# EAGLE design M106X (EAGLE 6.6.0)
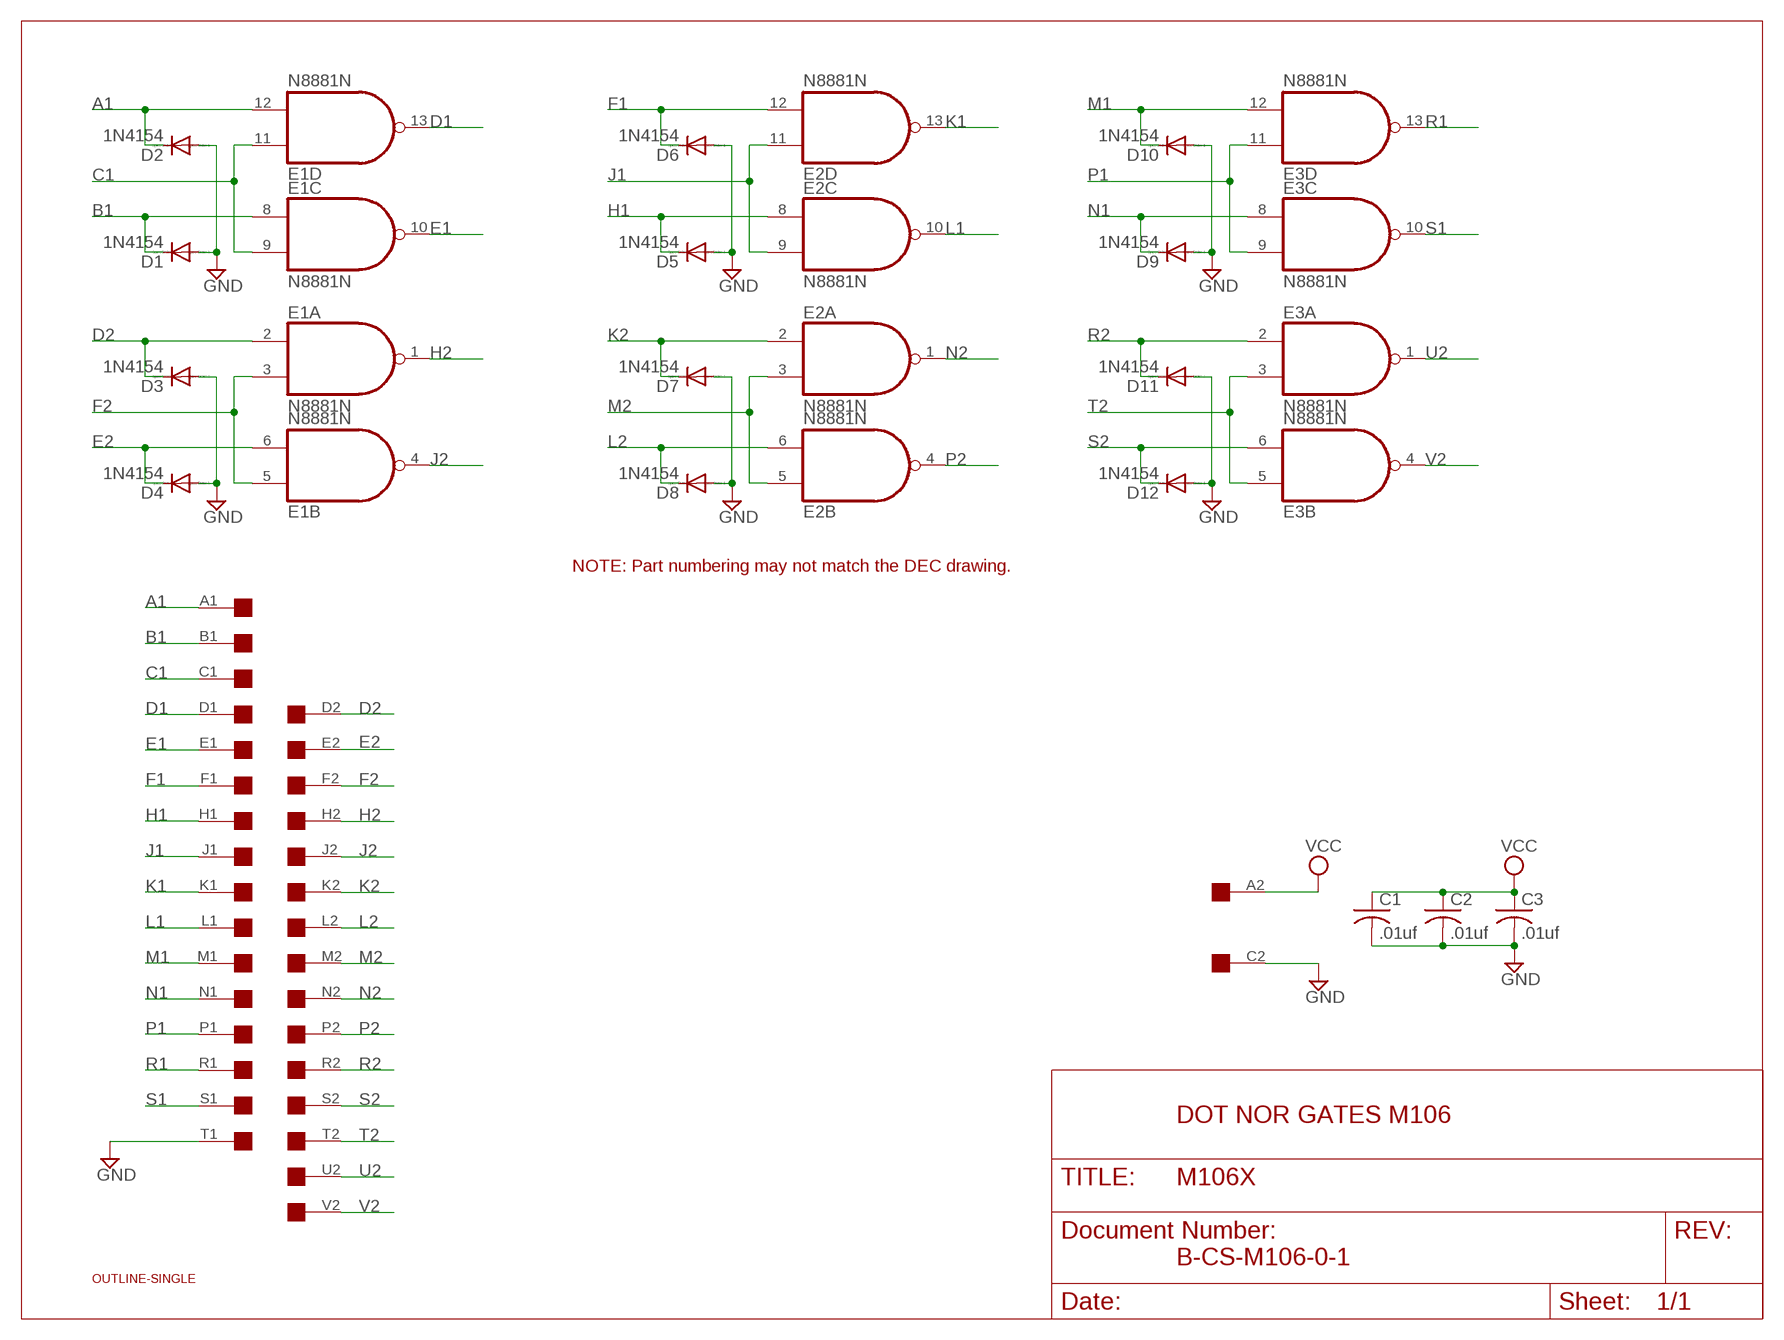
[diagram p0: schematic, sheet 1]

## Parts
C1  .01uf  C-US050-025X075  [C050-025X075]
C2  .01uf  C-US050-025X075  [C050-025X075]
C3  .01uf  C-US050-025X075  [C050-025X075]
D1  1N4154  1N4148DO35-10  [DO35-10]
D2  1N4154  1N4148DO35-10  [DO35-10]
D3  1N4154  1N4148DO35-10  [DO35-10]
D4  1N4154  1N4148DO35-10  [DO35-10]
D5  1N4154  1N4148DO35-10  [DO35-10]
D6  1N4154  1N4148DO35-10  [DO35-10]
D7  1N4154  1N4148DO35-10  [DO35-10]
D8  1N4154  1N4148DO35-10  [DO35-10]
D9  1N4154  1N4148DO35-10  [DO35-10]
D10  1N4154  1N4148DO35-10  [DO35-10]
D11  1N4154  1N4148DO35-10  [DO35-10]
D12  1N4154  1N4148DO35-10  [DO35-10]
E1  N8881N  [DIL14]
E2  N8881N  [DIL14]
E3  N8881N  [DIL14]
U$1  SINGLE  [EDGE-CON2]
U$4  OUTLINE-SINGLE  [SINGLE]

## Nets
A1: D2.C E1.12(D:I1) U$1.A1
B1: D1.C E1.8(C:I0) U$1.B1
C1: E1.9(C:I1) E1.11(D:I0) U$1.C1
D1: E1.13(D:O) U$1.D1
D2: D3.C E1.2(A:I0) U$1.D2
E1: E1.10(C:O) U$1.E1
E2: D4.C E1.6(B:I1) U$1.E2
F1: D6.C E2.12(D:I1) U$1.F1
F2: E1.3(A:I1) E1.5(B:I0) U$1.F2
GND [Supply]: C1.2 C2.2 C3.2 D1.A D2.A D3.A D4.A D5.A D6.A D7.A D8.A D9.A D10.A D11.A D12.A U$1.C2 U$1.T1
H1: D5.C E2.8(C:I0) U$1.H1
H2: E1.1(A:O) U$1.H2
J1: E2.9(C:I1) E2.11(D:I0) U$1.J1
J2: E1.4(B:O) U$1.J2
K1: E2.13(D:O) U$1.K1
K2: D7.C E2.2(A:I0) U$1.K2
L1: E2.10(C:O) U$1.L1
L2: D8.C E2.6(B:I1) U$1.L2
M1: D10.C E3.12(D:I1) U$1.M1
M2: E2.3(A:I1) E2.5(B:I0) U$1.M2
N1: D9.C E3.8(C:I0) U$1.N1
N2: E2.1(A:O) U$1.N2
P1: E3.9(C:I1) E3.11(D:I0) U$1.P1
P2: E2.4(B:O) U$1.P2
R1: E3.13(D:O) U$1.R1
R2: D11.C E3.2(A:I0) U$1.R2
S1: E3.10(C:O) U$1.S1
S2: D12.C E3.6(B:I1) U$1.S2
T2: E3.3(A:I1) E3.5(B:I0) U$1.T2
U2: E3.1(A:O) U$1.U2
V2: E3.4(B:O) U$1.V2
VCC [Supply]: C1.1 C2.1 C3.1 U$1.A2
Unconnected: U$1.B2 U$1.U1 U$1.V1

## Notes on the sheet
- NOTE: Part numbering may not match the DEC drawing.
- DOT NOR GATES M106
- B-CS-M106-0-1

## Power pins joined to a net without a drawn wire
GND: E1.7(P:GND) E2.7(P:GND) E3.7(P:GND)
VCC: E1.14(P:VCC) E2.14(P:VCC) E3.14(P:VCC)

## Library data of the parts
C1-C3 = rcl:C-US: CAPACITOR, American symbol
D1-D12 = diode:1N4148: DIODE high speed (Philips)
E1-E3 = dec-con:N8881: Quad 2-input NAND gate, open collector
U$1 = dec-con:SINGLE: Single-Height DEC board
U$4 = dec-con:OUTLINE-*: Board outlines for DEC boards.

## Net classes
1 Supply: width 0.813 mm

## Board
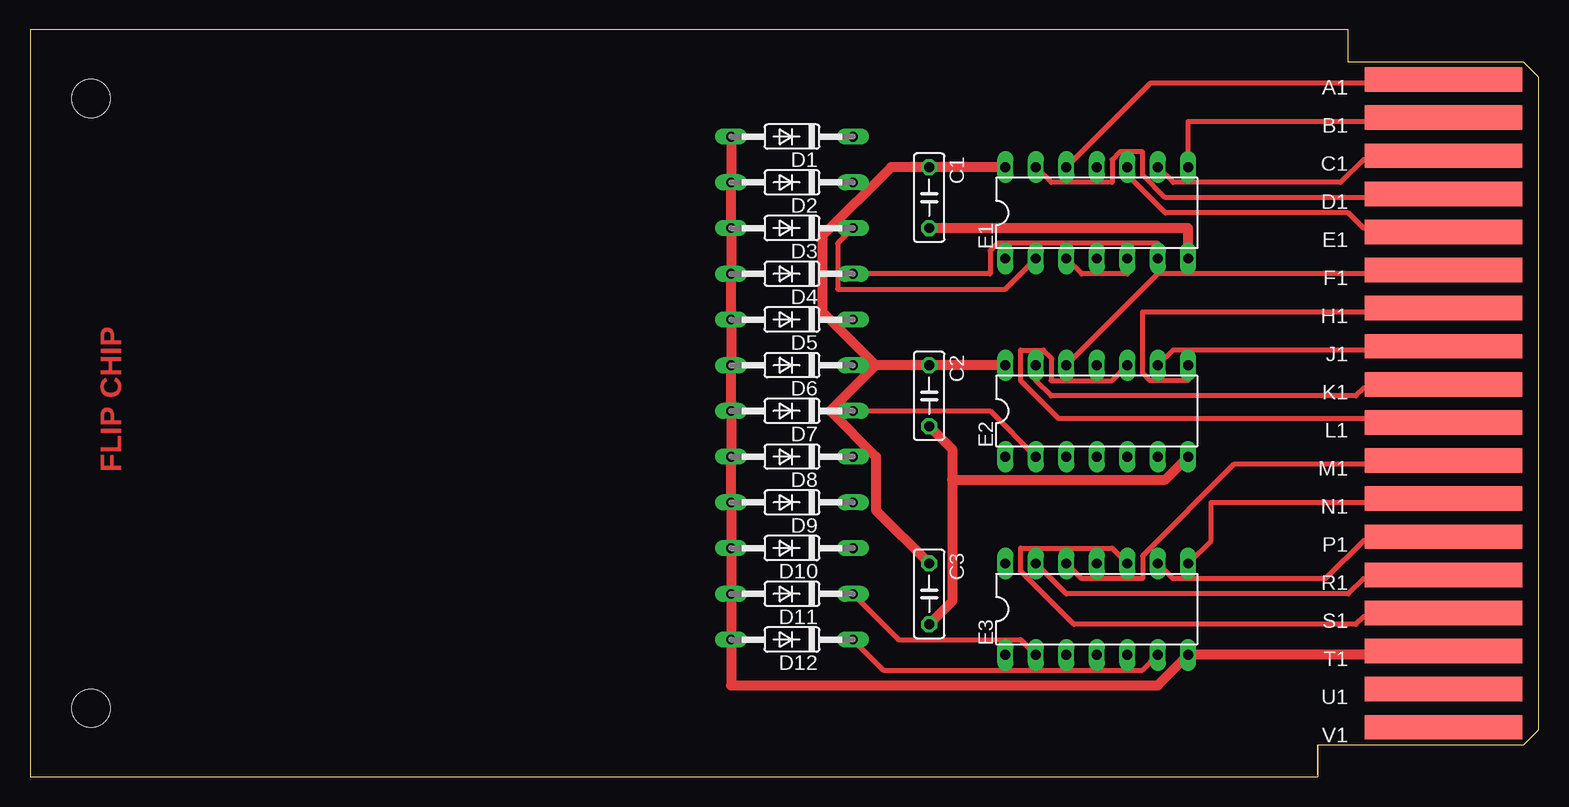
[diagram p1: board, top side]
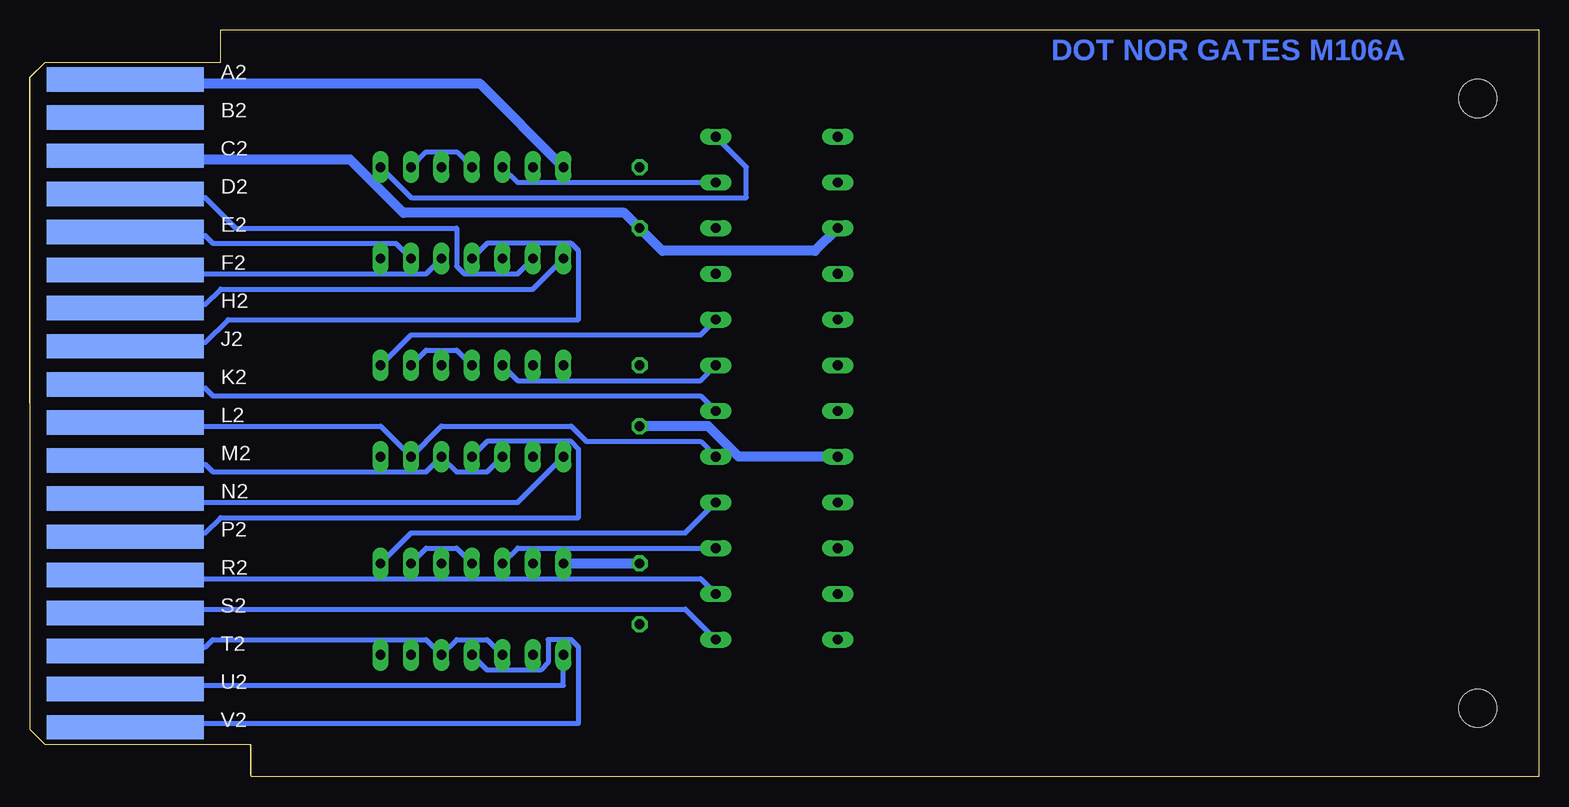
[diagram p2: board, bottom side, seen from below]

Size 125.73 x 62.23 mm. Coordinates in mm from the lower left corner, seen from the top.
Copper layers (1+16): Top 0.035mm / dielectric 1.5mm / Bottom 0.035mm
Design rules "16mils": minimum track width 16mil, minimum drill 32mil, track to track 15mil, track to pad 10mil, pad to pad 10mil, via to via 10mil, smd to smd 10mil, copper to edge 13mil, drill to drill 10mil, minimum pad ring 10mil, minimum via ring 8mil, stop-mask expansion 0mil, vias tented up to drill 0mil, thermal gap 10mil

### Footprints (pad centres in the part's own frame; a part is rotated, then mirrored left to right if it is on the bottom)
C050-025X075 = drill 0.813 octagon: 1 -2.54,0; 2 2.54,0
DO35-10 = drill 0.813 long: A 5.08,0; C -5.08,0
DIL14 = drill 0.813 long: 1 -7.62,-3.81; 2 -5.08,-3.81; 3 -2.54,-3.81; 4 0,-3.81; 5 2.54,-3.81; 6 5.08,-3.81; 7 7.62,-3.81; 8 7.62,3.81; 9 5.08,3.81; 10 2.54,3.81; 11 0,3.81; 12 -2.54,3.81; 13 -5.08,3.81; 14 -7.62,3.81
EDGE-CON2 = smd 13.106 x 2.032: A1 7.938,4.128; B1 7.938,7.303; C1 7.938,10.477; D1 7.938,13.652; E1 7.938,16.828; F1 7.938,20.003; H1 7.938,23.177; J1 7.938,26.352; K1 7.938,29.527; L1 7.938,32.703; M1 7.938,35.877; N1 7.938,39.053; P1 7.938,42.227; R1 7.938,45.403; S1 7.938,48.578; T1 7.938,51.752; U1 7.938,54.928; V1 7.938,58.102 | smd 13.106 x 2.032 bottom: A2 7.938,4.128; B2 7.938,7.303; C2 7.938,10.477; D2 7.938,13.652; E2 7.938,16.828; F2 7.938,20.003; H2 7.938,23.177; J2 7.938,26.352; K2 7.938,29.527; L2 7.938,32.703; M2 7.938,35.877; N2 7.938,39.053; P2 7.938,42.227; R2 7.938,45.403; S2 7.938,48.578; T2 7.938,51.752; U2 7.938,54.928; V2 7.938,58.102
SINGLE = hole 3.175: 120.65,56.515; 120.65,5.715

### Placement (x,y rotation side)
C1  74.93,48.26 270 top
C2  74.93,31.75 270 top
C3  74.93,15.24 270 top
D1  63.5,53.34 180 top
D2  63.5,49.53 180 top
D3  63.5,45.72 180 top
D4  63.5,41.91 180 top
D5  63.5,38.1 180 top
D6  63.5,34.29 180 top
D7  63.5,30.48 180 top
D8  63.5,26.67 180 top
D9  63.5,22.86 180 top
D10  63.5,19.05 180 top
D11  63.5,15.24 180 top
D12  63.5,11.43 180 top
E1  88.9,46.99 0 top
E2  88.9,30.48 0 top
E3  88.9,13.97 0 top
U$1  125.73,62.23 180 top
U$4  125.73,62.23 180 top

### Tracks (layer width: path | path; a pad name or v marks a point on that pad's centre or on a via)
A1
  Top 0.406: E1.12 93.34,57.78 117.47,57.78 U$1.A1
  Bottom 0.406: D2.C 85.09,49.53 E1.12
B1
  Top 0.406: E1.8 96.52,54.61 117.47,54.61 U$1.B1
  Bottom 0.406: D1.C 66.04,50.8 66.04,48.26 93.98,48.26 E1.8
C1
  Top 0.406: E1.9 95.25,49.53 109.22,49.53 111.12,51.44 117.47,51.44 U$1.C1
  Bottom 0.406: E1.11 90.17,52.07 92.71,52.07 E1.9
D1
  Top 0.406: E1.13 85.09,49.53 90.17,49.53 90.17,51.44 90.81,52.07 92.71,52.07 92.71,50.16 94.61,48.26 117.47,48.26 U$1.D1
D2
  Top 0.406: E1.2 81.28,40.64 67.31,40.64 67.31,44.45 D3.C
  Bottom 0.406: E1.2 85.09,41.91 89.53,41.91 90.17,42.55 90.17,45.72 108.58,45.72 111.12,48.26 117.47,48.26 U$1.D2
E1
  Top 0.406: E1.10 91.44,50.16 94.61,46.99 109.86,46.99 111.12,45.72 117.47,45.72 U$1.E1
E2
  Top 0.406: D4.C 80.01,41.91 80.01,43.81 80.64,44.45 93.98,44.45 E1.6
  Bottom 0.406: E1.6 95.25,44.45 110.49,44.45 111.12,45.09 117.47,45.09 U$1.E2
F1
  Top 0.406: E2.12 93.98,41.91 117.47,41.91 U$1.F1
  Bottom 0.406: D6.C 69.85,33.02 85.09,33.02 E2.12
F2
  Top 0.406: E1.3 87.63,41.91 91.44,41.91 E1.5
  Bottom 0.406: E1.5 92.71,41.91 117.47,41.91 U$1.F2
GND
  Top 0.813: U$1.T1 117.47,10.16 E3.7 93.98,7.62 58.42,7.62 D12.A D11.A D10.A D9.A D8.A D7.A D6.A D5.A D4.A D3.A D2.A D1.A | C3.2 76.83,14.61 76.83,24.77 | 76.83,24.77 76.83,27.3 C2.2 | E2.7 94.61,24.77 76.83,24.77 | C1.2 96.52,45.72 E1.7
  Bottom 0.813: D3.A 60.33,43.81 73.03,43.81 C1.2 76.2,46.99 94.61,46.99 99.06,51.44 117.47,51.44 U$1.C2 | C2.2 69.22,29.21 66.67,26.67 D8.A
H1
  Top 0.406: E2.8 96.52,33.02 93.34,33.02 92.71,33.66 92.71,38.73 117.47,38.73 U$1.H1
  Bottom 0.406: D5.C 69.85,36.83 93.98,36.83 E2.8
H2
  Bottom 0.406: E1.1 83.82,40.64 109.86,40.64 111.12,39.37 117.47,39.37 U$1.H2
J1
  Top 0.406: E2.9 95.25,35.56 117.47,35.56 U$1.J1
  Bottom 0.406: E2.11 90.17,35.56 92.71,35.56 E2.9
J2
  Bottom 0.406: E1.4 87.63,44.45 80.64,44.45 80.01,43.81 80.01,38.1 109.22,38.1 111.12,36.2 117.47,36.2 U$1.J2
K1
  Top 0.406: E2.13 83.82,33.02 85.09,31.75 110.49,31.75 111.12,32.38 117.47,32.38 U$1.K1
K2
  Top 0.406: E2.2 80.01,30.48 D7.C
  Bottom 0.406: D7.C 69.85,31.75 110.49,31.75 111.12,32.38 117.47,32.38 U$1.K2
L1
  Top 0.406: E2.10 90.17,33.02 85.09,33.02 85.09,34.92 84.45,35.56 82.55,35.56 82.55,33.02 85.72,29.84 117.47,29.84 U$1.L1
L2
  Bottom 0.406: D8.C 69.85,27.94 79.38,27.94 80.64,29.21 91.44,29.21 E2.6 96.52,29.21 117.47,29.21 U$1.L2
M1
  Top 0.406: E3.12 87.63,16.51 92.71,16.51 92.71,18.41 100.33,26.04 117.47,26.04 U$1.M1
  Bottom 0.406: D10.C 85.09,19.05 E3.12
M2
  Bottom 0.406: E2.3 87.63,25.4 90.17,25.4 E2.5 92.71,25.4 110.49,25.4 111.12,26.04 117.47,26.04 U$1.M2
N1
  Top 0.406: E3.8 98.42,19.68 98.42,22.86 117.47,22.86 U$1.N1
  Bottom 0.406: D9.C 71.12,20.32 93.98,20.32 E3.8
N2
  Bottom 0.406: E2.1 85.09,22.86 117.47,22.86 U$1.N2
P1
  Top 0.406: E3.9 95.25,16.51 107.95,16.51 111.12,19.68 117.47,19.68 U$1.P1
  Bottom 0.406: E3.11 90.17,19.05 92.71,19.05 E3.9
P2
  Bottom 0.406: E2.4 87.63,27.94 80.64,27.94 80.01,27.3 80.01,21.59 109.86,21.59 111.12,20.32 117.47,20.32 U$1.P2
R1
  Top 0.406: E3.13 86.36,15.24 109.86,15.24 111.12,16.51 117.47,16.51 U$1.R1
R2
  Top 0.406: E3.2 82.55,11.43 72.39,11.43 D11.C
  Bottom 0.406: D11.C 69.85,16.51 117.47,16.51 U$1.R2
S1
  Top 0.406: E3.10 90.17,19.05 82.55,19.05 82.55,17.14 87,12.7 110.49,12.7 111.12,13.34 117.47,13.34 U$1.S1
S2
  Top 0.406: E3.6 92.71,8.89 71.12,8.89 D12.C
  Bottom 0.406: D12.C 71.12,13.97 117.47,13.97 U$1.S2
T2
  Bottom 0.406: E3.3 87.63,11.43 90.17,11.43 E3.5 92.71,11.43 110.49,11.43 111.12,10.79 117.47,10.79 U$1.T2
U2
  Bottom 0.406: E3.1 81.28,7.62 117.47,7.62 U$1.U2
V2
  Bottom 0.406: E3.4 87.63,8.89 83.19,8.89 82.55,9.53 82.55,11.43 80.64,11.43 80.01,10.79 80.01,4.45 117.47,4.45 U$1.V2
VCC
  Top 0.813: E2.14 C2.1 70.48,34.29 | C3.1 70.48,22.23 70.48,26.67 66.67,30.48 70.48,34.29 | E1.14 C1.1 71.75,50.8 66.04,45.09 66.04,38.73 70.48,34.29
  Bottom 0.813: E3.14 C3.1 | E1.14 88.27,57.78 117.47,57.78 U$1.A2

### Text on the board
Top: FLIP CHIP
Bottom: DOT NOR GATES M106A